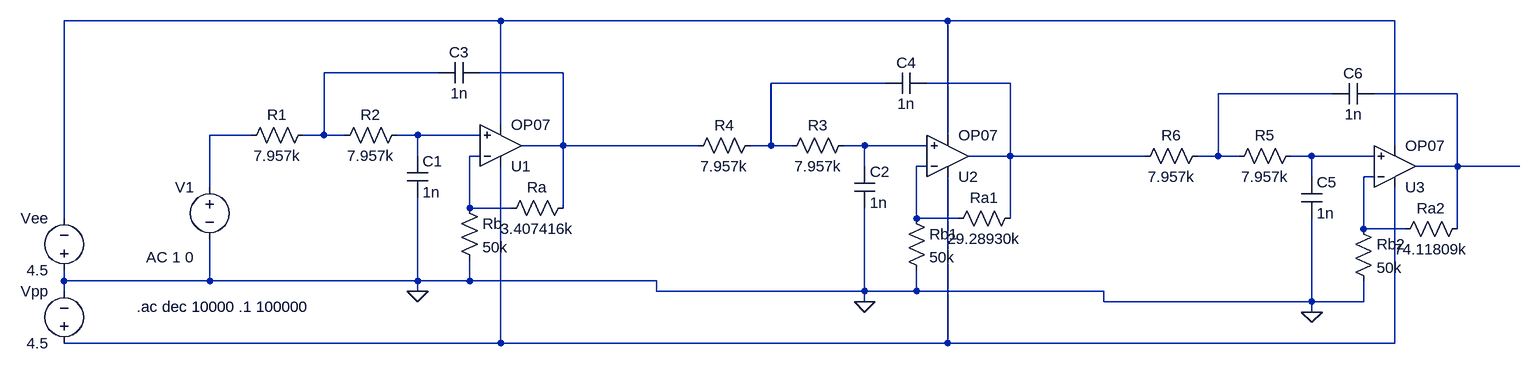
[diagram p0: schematic SallenAndKeySchem.asc]
SallenAndKeySchem.asc, the LTspice schematic file:
Version 4
SHEET 1 1828 1204
WIRE 256 -32 -416 -32
WIRE 944 -32 256 -32
WIRE 1632 -32 944 -32
WIRE 160 48 -16 48
WIRE 352 48 224 48
WIRE 848 64 672 64
WIRE 1040 64 912 64
WIRE 1536 80 1360 80
WIRE 1728 80 1600 80
WIRE 256 128 256 -32
WIRE -128 144 -192 144
WIRE -16 144 -16 48
WIRE -16 144 -48 144
WIRE 16 144 -16 144
WIRE 128 144 96 144
WIRE 224 144 128 144
WIRE 944 144 944 -32
WIRE 352 160 352 48
WIRE 352 160 288 160
WIRE 560 160 352 160
WIRE 672 160 672 64
WIRE 672 160 640 160
WIRE 704 160 672 160
WIRE 816 160 784 160
WIRE 912 160 816 160
WIRE 1632 160 1632 -32
WIRE 128 176 128 144
WIRE 224 176 208 176
WIRE 1040 176 1040 64
WIRE 1040 176 976 176
WIRE 1248 176 1040 176
WIRE 1360 176 1360 80
WIRE 1360 176 1328 176
WIRE 1392 176 1360 176
WIRE 1504 176 1472 176
WIRE 1600 176 1504 176
WIRE 816 192 816 160
WIRE 912 192 896 192
WIRE 1728 192 1728 80
WIRE 1728 192 1664 192
WIRE 1824 192 1728 192
WIRE 1504 208 1504 176
WIRE 1600 208 1584 208
WIRE -192 224 -192 144
WIRE 208 256 208 176
WIRE 272 256 208 256
WIRE 352 256 352 160
WIRE -416 272 -416 -32
WIRE 896 272 896 192
WIRE 960 272 896 272
WIRE 1040 272 1040 176
WIRE 1584 288 1584 208
WIRE 1648 288 1584 288
WIRE 1728 288 1728 192
WIRE -416 368 -416 352
WIRE -192 368 -192 304
WIRE -192 368 -416 368
WIRE 128 368 128 240
WIRE 128 368 -192 368
WIRE 208 368 208 336
WIRE 208 368 128 368
WIRE 496 368 208 368
WIRE -416 384 -416 368
WIRE 128 384 128 368
WIRE 496 384 496 368
WIRE 816 384 816 256
WIRE 816 384 496 384
WIRE 896 384 896 352
WIRE 896 384 816 384
WIRE 1184 384 896 384
WIRE 816 400 816 384
WIRE 1184 400 1184 384
WIRE 1504 400 1504 272
WIRE 1504 400 1184 400
WIRE 1584 400 1584 368
WIRE 1584 400 1504 400
WIRE 1504 416 1504 400
WIRE 256 464 256 192
WIRE 256 464 -416 464
WIRE 944 464 944 208
WIRE 944 464 256 464
WIRE 1632 464 1632 224
WIRE 1632 464 944 464
FLAG 128 384 0
FLAG 816 400 0
FLAG 1504 416 0
SYMBOL Opamps\\OP07 256 224 M180
SYMATTR InstName U1
SYMBOL res 368 240 R90
WINDOW 0 0 56 VBottom 2
WINDOW 3 32 56 VTop 2
SYMATTR InstName Ra
SYMATTR Value 3.407416k
SYMBOL res 192 240 R0
SYMATTR InstName Rb
SYMATTR Value 50k
SYMBOL cap 112 176 R0
SYMATTR InstName C1
SYMATTR Value 1n
SYMBOL res 0 160 R270
WINDOW 0 32 56 VTop 2
WINDOW 3 0 56 VBottom 2
SYMATTR InstName R2
SYMATTR Value 7.957k
SYMBOL res -144 160 R270
WINDOW 0 32 56 VTop 2
WINDOW 3 0 56 VBottom 2
SYMATTR InstName R1
SYMATTR Value 7.957k
SYMBOL cap 160 64 R270
WINDOW 0 32 32 VTop 2
WINDOW 3 0 32 VBottom 2
SYMATTR InstName C3
SYMATTR Value 1n
SYMBOL voltage -192 208 M0
WINDOW 123 24 124 Left 2
WINDOW 39 0 0 Left 2
SYMATTR Value2 AC 1 0
SYMATTR InstName V1
SYMATTR Value ""
SYMBOL voltage -416 480 R180
WINDOW 0 24 96 Left 2
WINDOW 3 24 16 Left 2
SYMATTR InstName Vpp
SYMATTR Value 4.5
SYMBOL voltage -416 368 R180
WINDOW 0 24 96 Left 2
WINDOW 3 24 16 Left 2
SYMATTR InstName Vee
SYMATTR Value 4.5
SYMBOL Opamps\\OP07 944 240 M180
SYMATTR InstName U2
SYMBOL res 1056 256 R90
WINDOW 0 0 56 VBottom 2
WINDOW 3 32 56 VTop 2
SYMATTR InstName Ra1
SYMATTR Value 29.28930k
SYMBOL res 880 256 R0
SYMATTR InstName Rb1
SYMATTR Value 50k
SYMBOL cap 800 192 R0
SYMATTR InstName C2
SYMATTR Value 1n
SYMBOL res 688 176 R270
WINDOW 0 32 56 VTop 2
WINDOW 3 0 56 VBottom 2
SYMATTR InstName R3
SYMATTR Value 7.957k
SYMBOL res 544 176 R270
WINDOW 0 32 56 VTop 2
WINDOW 3 0 56 VBottom 2
SYMATTR InstName R4
SYMATTR Value 7.957k
SYMBOL cap 848 80 R270
WINDOW 0 32 32 VTop 2
WINDOW 3 0 32 VBottom 2
SYMATTR InstName C4
SYMATTR Value 1n
SYMBOL Opamps\\OP07 1632 256 M180
SYMATTR InstName U3
SYMBOL res 1744 272 R90
WINDOW 0 0 56 VBottom 2
WINDOW 3 32 56 VTop 2
SYMATTR InstName Ra2
SYMATTR Value 74.11809k
SYMBOL res 1568 272 R0
SYMATTR InstName Rb2
SYMATTR Value 50k
SYMBOL cap 1488 208 R0
SYMATTR InstName C5
SYMATTR Value 1n
SYMBOL res 1376 192 R270
WINDOW 0 32 56 VTop 2
WINDOW 3 0 56 VBottom 2
SYMATTR InstName R5
SYMATTR Value 7.957k
SYMBOL res 1232 192 R270
WINDOW 0 32 56 VTop 2
WINDOW 3 0 56 VBottom 2
SYMATTR InstName R6
SYMATTR Value 7.957k
SYMBOL cap 1536 96 R270
WINDOW 0 32 32 VTop 2
WINDOW 3 0 32 VBottom 2
SYMATTR InstName C6
SYMATTR Value 1n
TEXT -304 408 Left 2 !.ac dec 10000 .1 100000

The netlist it stands for:
* SallenAndKeySchem.asc
XU1 N009 N011 N015 N001 N003 LT1001  ; OP07, pins In+ In- V+ V- OUT
Ra N003 N011 3.407416k
Rb N011 0 50k
C1 N009 0 1n
R2 N002 N009 7.957k
R1 N008 N002 7.957k
C3 N002 N003 1n
V1 N008 0 AC 1 0
Vpp N015 0 4.5
Vee 0 N001 4.5
XU2 N010 N013 N015 N001 N005 LT1001  ; OP07, pins In+ In- V+ V- OUT
Ra1 N005 N013 29.28930k
Rb1 N013 0 50k
C2 N010 0 1n
R3 N004 N010 7.957k
R4 N003 N004 7.957k
C4 N004 N005 1n
XU3 N012 N014 N015 N001 N007 LT1001  ; OP07, pins In+ In- V+ V- OUT
Ra2 N007 N014 74.11809k
Rb2 N014 0 50k
C5 N012 0 1n
R5 N006 N012 7.957k
R6 N005 N006 7.957k
C6 N006 N007 1n
.ac dec 10000 .1 100000
.lib LTC.lib
.backanno
.end